# Altium project PCB_Project.PrjPcb
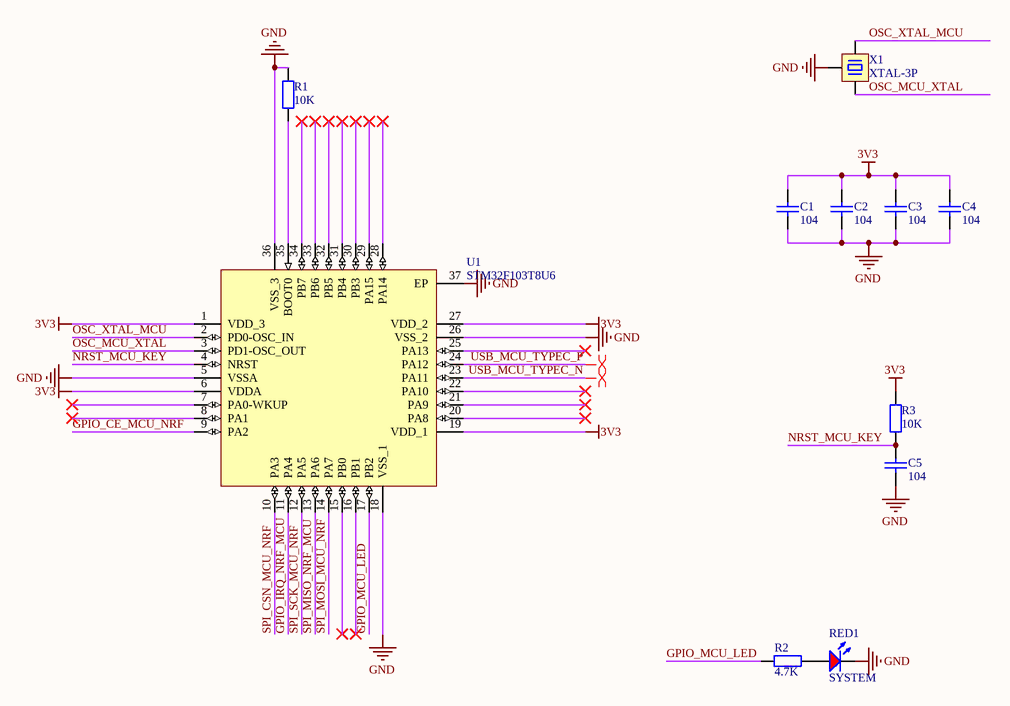
[diagram p0: MCU.SchDoc]
3 sheets, 38 parts. Net scope: global (net labels, ports and power ports of the same name join across sheets).
Board file: USB_Receiver.PcbDoc
Sheets:
  MCU.SchDoc
  POWER.SchDoc
  NRF24L01.SchDoc

## Sheet MCU.SchDoc
size A4

### Parts
C1  104  [Cap-0402-M]
C2  104  [Cap-0402-M]
C3  104  [Cap-0402-M]
C4  104  [Cap-0402-M]
C5  104  [Cap-0402-M]
R1  10K  [Res-0402-M]
R2  4.7K  [Res-0402-M]
R3  10K  [Res-0402-M]
RED1  SYSTEM  [LED_0603_R]
U1  STM32F103T8U6  [STM-VFQFPN36_L _2]
X1  XTAL-3P  [OSC 3213-3P]

### Nets
3V3: C1.2 C2.2 C3.2 C4.2 R3.2 U1.1(VDD_3) U1.6(VDDA) U1.19(VDD_1) U1.27(VDD_2)
GND: C1.1 C2.1 C3.1 C4.1 C5.1 R1.2 RED1.2(K) U1.5(VSSA) U1.18(VSS_1) U1.26(VSS_2) U1.36(VSS_3) U1.37(EP) X1.2
GPIO_CE_MCU_NRF: U1.9(PA2)
GPIO_IRQ_NRF_MCU: U1.11(PA4)
GPIO_MCU_LED: R2.2 U1.17(PB2)
NRST_MCU_KEY: C5.2 R3.1 U1.4(NRST)
OSC_MCU_XTAL: U1.3(PD1-OSC_OUT) X1.3
OSC_XTAL_MCU: U1.2(PD0-OSC_IN) X1.1
SPI_CSN_MCU_NRF: U1.10(PA3)
SPI_MISO_NRF_MCU: U1.13(PA6)
SPI_MOSI_MCU_NRF: U1.14(PA7)
SPI_SCK_MCU_NRF: U1.12(PA5)
USB_MCU_TYPEC_N: U1.23(PA11)
USB_MCU_TYPEC_P: U1.24(PA12)
NetR1_1: R1.1 U1.35(BOOT0)
NetR2_1: R2.1 RED1.1(A)

Not connected (* = marked no-connect by the designer): U1 7(PA0-WKUP)* 8(PA1)* 15(PB0)* 16(PB1)* 20(PA8)* 21(PA9)* 22(PA10)* 25(PA13)* 28(PA14)* 29(PA15)* 30(PB3)* 31(PB4)* 32(PB5)* 33(PB6)* 34(PB7)*

### Layout directives
differential pair: USB_MCU_TYPEC_N, USB_MCU_TYPEC_P

### Library data of the parts
C1-C5 = CAP: 贴片陶瓷电容
R1-R3 = RES: 贴片电阻
RED1 = LED_SMD_RED: 发光二极管; ComponentLink1Description: 供应商链接; ComponentLink1URL: http://www.szlcsc.com/product/details_2659.html; Package: 0603; Supplier: LC; SuppliersPartNumber: C2286
U1 = STM32F103T8U6: ARM Cortex-M3 32-bit MCU, 64 KB Flash, 20 KB Internal RAM, 26 I/Os, 36-pin VFQFPN, -40 to 85 degC, Tray; A/D Converter: 2x12-bit (10 Channel); FLASH Size (Prog) (kB): 64; I/Os (High Current): 26; Internal RAM Size (kB): 20; Operating Frequency(F) (Processor speed) (MHz): 72; Supply Voltage(Vcc) min (V): 2; DatasheetVersion: Rev. 16; PackageVersion: Rev. 16, 08/2013; PackageReference: VFQFPN36; PackageDescription: 36-Pin Quad Flat No-Lead, 6 x 6 x 1.0 mm Body, 0.5 mm Pitch, Exposed Pad; Supplier 1: Digi-Key; Supplier Part Number 1: 497-11532-ND; Supplier 2: Farnell; Supplier Part Number 2: 1606329; Supplier 3: Newark; Supplier Part Number 3: 11N8298; Supplier 4: Mouser; Supplier Part Number 4: 511-STM32F103T8U6; Core: ARM Cortex-M3; Packing: Tray; Mounting Technology: Surface Mount; PartNumber: STM32F103T8U6; ComponentLink1Description: Manufacturer URL; ComponentLink1URL: http://www.st.com/web/en/home.html; ComponentLink2Description: Datasheet; ComponentLink2URL: http://www.st.com/st-web-ui/static/active/en/resource/technical/document/datasheet/CD00161566.pdf; ComponentLink3Description: Package Specification; ComponentLink3URL: http://www.st.com/st-web-ui/static/active/en/resource/technical/document/datasheet/CD00161561.pdf
X1 = XTAL-3P: 3脚无源晶振带电容

## Sheet POWER.SchDoc
size A4
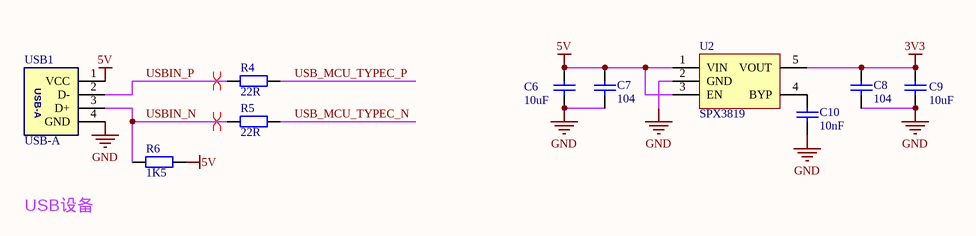
[diagram p1: POWER.SchDoc]

### Parts
C6  10uF  [Cap-0603-M]
C7  104  [Cap-0402-M]
C8  104  [Cap-0402-M]
C9  10uF  [Cap-0603-M]
C10  10nF  [Cap-0402-M]
R4  22R  [Res-0402-M]
R5  22R  [Res-0402-M]
R6  1K5  [Res-0402-M]
U2  SPX3819  [SOT23-5]
USB1  USB-A  [USB_A/P_B]

### Nets
3V3: C8.2 C9.2 U2.5(VOUT)
5V: C6.2 C7.2 R6.2 U2.1(VIN) U2.3(EN) USB1.1(VCC)
GND: C6.1 C7.1 C8.1 C9.1 C10.1 U2.2(GND) USB1.4(GND)
USB_MCU_TYPEC_N: R5.2
USB_MCU_TYPEC_P: R4.2
USBIN_N: R5.1 R6.1 USB1.3(D+)
USBIN_P: R4.1 USB1.2(D-)
NetC10_2: C10.2 U2.4(BYP)

### Layout directives
differential pair: USBIN_N, USBIN_P

### Notes on the sheet
- USB设备

### Library data of the parts
C6-C10 = CAP: 贴片陶瓷电容
R4-R6 = RES: 贴片电阻

## Sheet NRF24L01.SchDoc
size A4
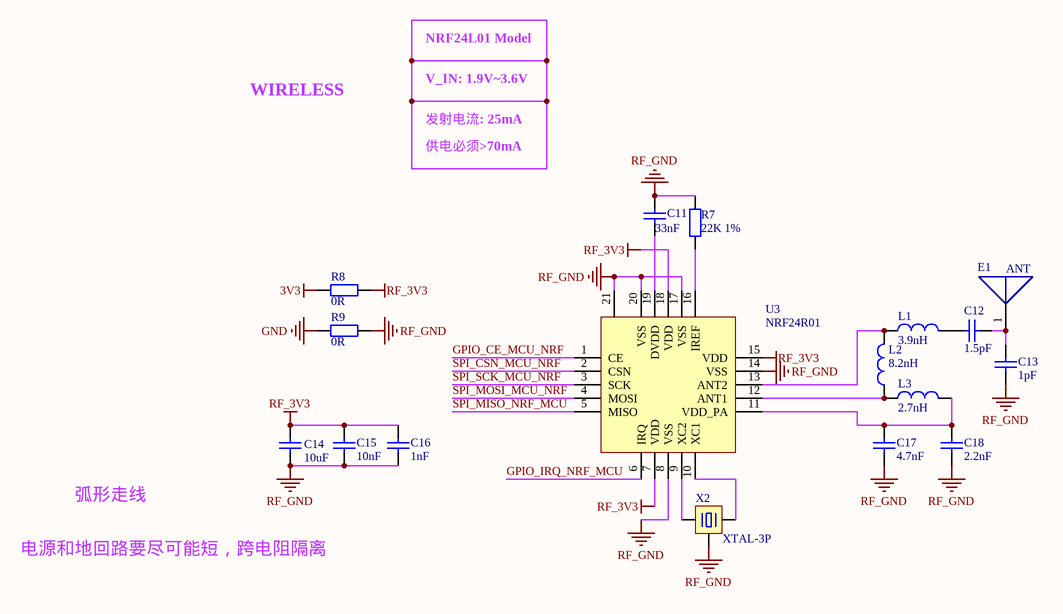
[diagram p2: NRF24L01.SchDoc]

### Parts
C11  33nF  [CAP-0402-M]
C12  1.5pF  [Cap-0402-M]
C13  1pF  [Cap-0402-M]
C14  10uF  [Cap-0603-M]
C15  10nF  [CAP-0402-M]
C16  1nF  [CAP-0402-M]
C17  4.7nF  [Cap-0402-M]
C18  2.2nF  [Cap-0402-M]
E1  ANT  [AN2051-245]
L1  3.9nH  [L-0402]
L2  8.2nH  [L-0402]
L3  2.7nH  [L-0402]
R7  22K 1%  [Res-0402-M]
R8  0R  [Res-0402-M]
R9  0R  [Res-0402-M]
U3  NRF24R01  [QFN20 4x4]
X2  XTAL-3P  [OSC 3213-3P]

### Nets
3V3: R8.1
GND: R9.1
RF_3V3: C14.2 C15.2 C16.2 R8.2 U3.7(VDD) U3.15(VDD) U3.18(VDD)
RF_GND: C11.1 C13.1 C14.1 C15.1 C16.1 C17.1 C18.1 R7.1 R9.2 U3.8(VSS) U3.14(VSS) U3.17(VSS) U3.20(VSS) U3.21 X2.2
GPIO_CE_MCU_NRF: U3.1(CE)
GPIO_IRQ_NRF_MCU: U3.6(IRQ)
SPI_CSN_MCU_NRF: U3.2(CSN)
SPI_MISO_NRF_MCU: U3.5(MISO)
SPI_MOSI_MCU_NRF: U3.4(MOSI)
SPI_SCK_MCU_NRF: U3.3(SCK)
NetC11_2: C11.2 U3.19(DVDD)
NetC12_1: C12.1 L1.2
NetC12_2: C12.2 C13.2 E1.1
NetC17_2: C17.2 C18.2 L3.2 U3.11(VDD_PA)
NetL1_1: L1.1 L2.2 U3.13(ANT2)
NetL2_1: L2.1 L3.1 U3.12(ANT1)
NetR7_2: R7.2 U3.16(IREF)
NetU3_9: U3.9(XC2) X2.1
NetU3_10: U3.10(XC1) X2.3

### Notes on the sheet
- NRF24L01 Model
- WIRELESS
- V_IN: 1.9V~3.6V
- 发射电流: 25mA
- 供电必须>70mA
- 弧形走线
- 电源和地回路要尽可能短，跨电阻隔离

### Library data of the parts
C11-C18 = CAP: 贴片陶瓷电容
L1-L3 = INDUCTOR: 贴片电感
R7-R9 = RES: 贴片电阻
U3 = NRF24R01: 2.4G无线
X2 = XTAL-3P: 3脚无源晶振带电容
E1 = ANT: Published: 12-August-2017; Publisher: mazhongwei; PackageReference: R_1206

## Nets that join several sheets
3V3: MCU (9 pins), POWER (C8.2 C9.2 U2.5), NRF24L01 (R8.1)
GND: MCU (13 pins), POWER (7 pins), NRF24L01 (R9.1)
GPIO_CE_MCU_NRF: MCU (U1.9), NRF24L01 (U3.1)
GPIO_IRQ_NRF_MCU: MCU (U1.11), NRF24L01 (U3.6)
SPI_CSN_MCU_NRF: MCU (U1.10), NRF24L01 (U3.2)
SPI_MISO_NRF_MCU: MCU (U1.13), NRF24L01 (U3.5)
SPI_MOSI_MCU_NRF: MCU (U1.14), NRF24L01 (U3.4)
SPI_SCK_MCU_NRF: MCU (U1.12), NRF24L01 (U3.3)
USB_MCU_TYPEC_N: MCU (U1.23), POWER (R5.2)
USB_MCU_TYPEC_P: MCU (U1.24), POWER (R4.2)